# Altium schematic sheet External Power Amplifier.SchDoc
size A4; SheetNumber: 3; SheetTotal: 10
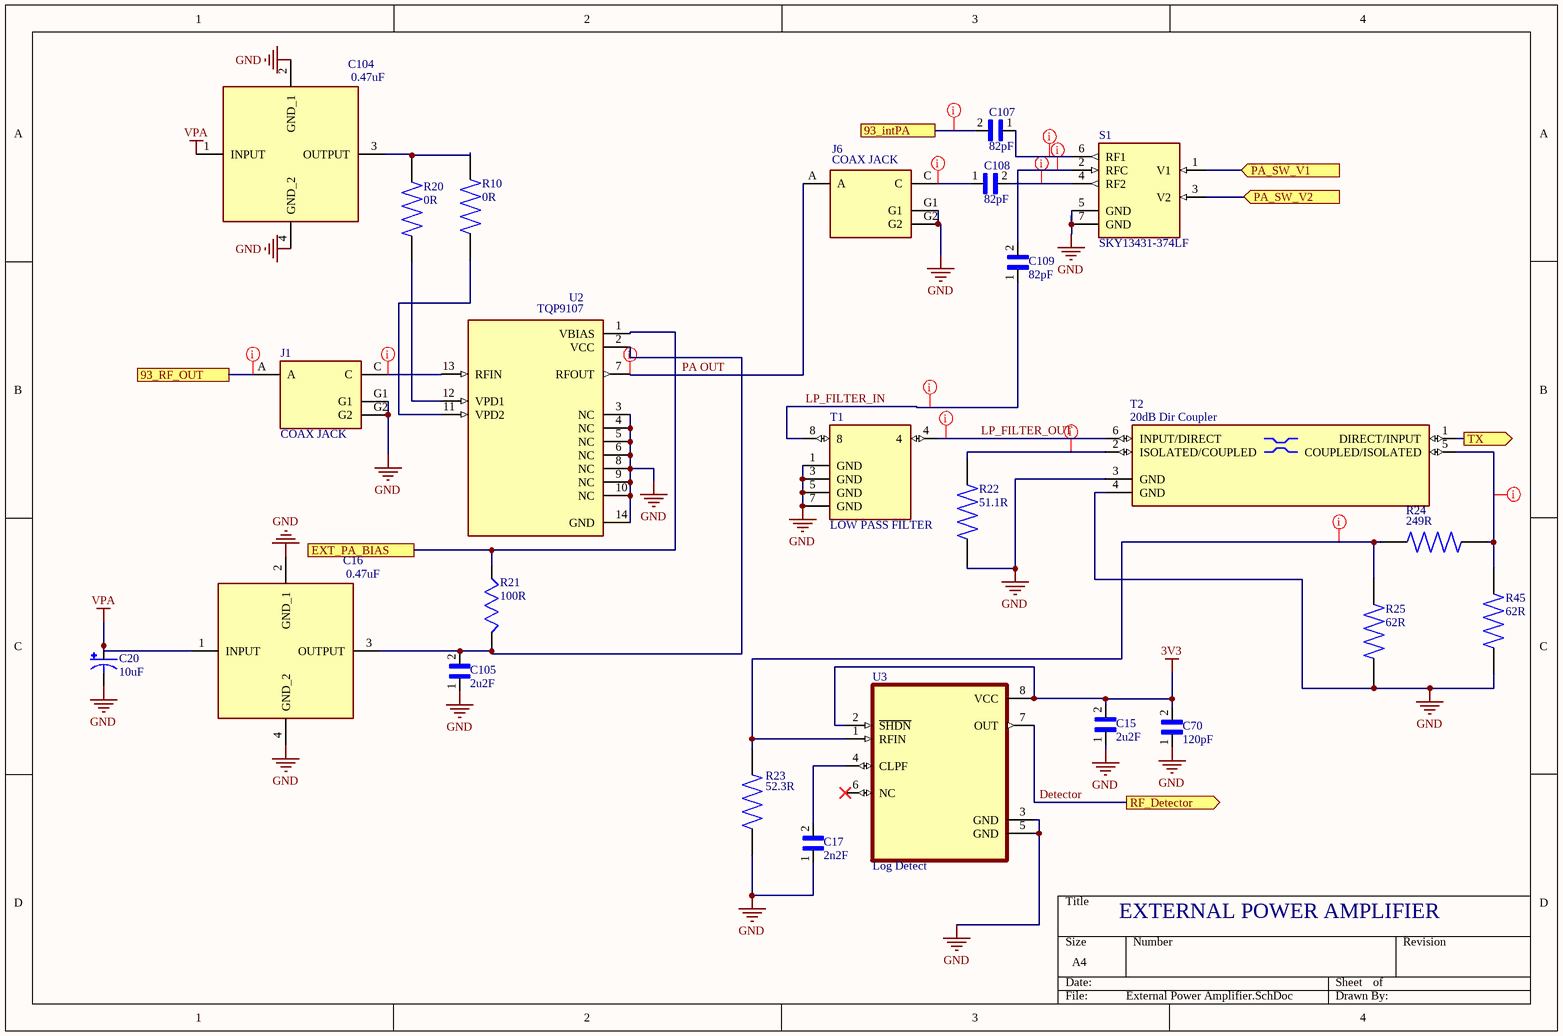
[diagram p0: External Power Amplifier.SchDoc]

## Parts
C15  2u2F  [CAPC0603X35N]
C16  0.47uF  [NFM18CC101R1C3D]
C17  2n2F  [CAPC1005X55N]
C20  10uF  [2917(POL)]
C70  120pF  [CAPC0603X33N]
C104  0.47uF  [NFM18CC101R1C3D]
C105  2u2F  [CAPC0603X35N]
C107  82pF  [CAPC1005X55N]
C108  82pF  [CAPC1005X55N]
C109  82pF  [CAPC1005X55N]
J1  COAX JACK  [SW_MS-156HF(01)]
J6  COAX JACK  [SW_MS-156HF(01)]
R10  0R  [RESC1005X37N]
R20  0R  [RESC1005X37N]
R21  100R  [RESC1005X40]
R22  51.1R  [RESC1005X40N]
R23  52.3R  [RES_ERJ2RKF52R3X]
R24  249R  [RESC1005X40N]
R25  62R  [RESC1005X40N]
R45  62R  [RESC1005X40N]
S1  SKY13431-374LF  [SW_SKY13431-374LF]
T1  LOW PASS FILTER  [FIL_0900LP15B0063E]
T2  20dB Dir Coupler  [COUPLER_DC1722J5020AHF]
U2  TQP9107  [IC_TQP9107]
U3  Log Detect  [SOP65P490X110-8N]

## Ports
93_intPA (see System Overview[2A], UHF RFID READER IC[4C]), 93_RF_OUT (see System Overview[2A], UHF RFID READER IC[4A]), EXT_PA_BIAS (see System Overview[2A], External interfaces and connections[4C]), PA_SW_V1 (in, see System Overview[2A], External interfaces and connections[3C], Microcontroller[1B]), PA_SW_V2 (in, see System Overview[2B], External interfaces and connections[3D], Microcontroller[3A]), RF_Detector (out, see System Overview[2A], External interfaces and connections[4D], Microcontroller[2A]), TX (out, see System Overview[3A], Carrier Cancellation Circuit[1B])

## Nets
3V3: C15.2 C70.2 U3.2(~{SHDN}) U3.8(VCC)
GND: C15.1 C16.2(GND_1) C16.4(GND_2) C17.1 C20.2(NEG) C70.1 C104.2(GND_1) C104.4(GND_2) C105.1 J1.G1 J1.G2 J6.G1 J6.G2 R22.1 R23.1 R25.1 R45.1 S1.5(GND) S1.7(GND) T1.1(GND) T1.3(GND) T1.5(GND) T1.7(GND) T2.3(GND) T2.4(GND) U2.3(NC) U2.4(NC) U2.5(NC) U2.6(NC) U2.8(NC) U2.9(NC) U2.10(NC) U2.14(GND) U3.3(GND) U3.5(GND)
VPA: C16.1(INPUT) C20.1(POS) C104.1(INPUT)
93_intPA: C107.2 ; port 93_intPA
93_RF_OUT: J1.A ; port 93_RF_OUT
Detector: U3.7(OUT) ; port RF_Detector
EXT_PA_BIAS: R21.2 U2.1(VBIAS) ; port EXT_PA_BIAS
LP_FILTER_IN: C109.1 T1.8
LP_FILTER_OUT: T1.4 T2.6(INPUT/DIRECT)
PA OUT: J6.A U2.7(RFOUT)
PA_SW_V1: S1.1(V1) ; port PA_SW_V1
PA_SW_V2: S1.3(V2) ; port PA_SW_V2
TX: T2.1(DIRECT/INPUT) ; port TX
NetC16_3: C16.3(OUTPUT) C105.2 R21.1 U2.2(VCC)
NetC17_2: C17.2 U3.4(CLPF)
NetC104_3: C104.3(OUTPUT) R10.2 R20.2
NetC107_1: C107.1 S1.6(RF1)
NetC108_1: C108.1 J6.C
NetC108_2: C108.2 S1.4(RF2)
NetC109_2: C109.2 S1.2(RFC)
NetJ1_C: J1.C U2.13(RFIN)
NetR10_1: R10.1 U2.11(VPD2)
NetR20_1: R20.1 U2.12(VPD1)
NetR22_2: R22.2 T2.2(ISOLATED/COUPLED)
NetR23_2: R23.2 R24.1 R25.2 U3.1(RFIN)
NetR24_2: R24.2 R45.2 T2.5(COUPLED/ISOLATED)

Not connected (* = marked no-connect by the designer): U3 6(NC)*

## Layout directives
net class RF_50: 93_intPA, 93_RF_OUT, LP_FILTER_IN, LP_FILTER_OUT, NetC107_1, NetC108_1, NetC108_2, NetC109_2, NetJ1_C, NetR22_2, NetR23_2, NetR24_2, PA OUT

## Notes on the sheet
- EXTERNAL POWER AMPLIFIER

## Library data of the parts
C15 C105 = GRM033R60J225ME15D: SMD Capacitor X5R(EIA) with Capacitance: 2.2uF Tol. 20%. Rated Voltage: 6.3Vdc; Package: None; Price: None; Value: *; MP: GRM033R60J225ME15D; Availability: Unavailable
C16 C104 = NFM18PS474R0J3D: Capacitor; Manufacturer_Name: Murata Electronics; Datasheet Link: https://psearch.en.murata.com/capacitor/product/NFM18PS474R0J3%23.html; Height: 0.7mm; Manufacturer_Part_Number: NFM18PS474R0J3D; Mouser Part Number: 81-NFM18PS474R0J3D; Mouser Price/Stock: https://www.mouser.co.uk/ProductDetail/Murata-Electronics/NFM18PS474R0J3D?qs=OWtbBJ4e7yHgIGJxSdBqtA%3D%3D; Arrow Part Number: NFM18PS474R0J3D; Arrow Price/Stock: https://www.arrow.com/en/products/nfm18ps474r0j3d/murata-manufacturing?region=nac
C17 = GRM155R71H222KA01D: SMD capacitor X7R(EIA) with capacitance 2200pF Tol.10%. Rated voltage 50Vdc 125C; MF: Murata; SnapEDA_Link: https://www.snapeda.com/parts/GRM155R71H222KA01D/Murata%20Electronics%20North%20America/view-part/326477/?ref=snap; Package: 1005 Taiyo Yuden; Value: *; MP: GRM155R71H222KA01D; Purchase-URL: https://pricing.snapeda.com/search/part/GRM155R71H222KA01D/?ref=eda; Availability: Good; Price: None
C20 = ECASD41C106M060K00: 10 ÂµF 16 V Aluminum - Polymer Capacitors 2917 (7343 Metric) 60mOhm 1000 Hrs @ 105Â°C; MF: Murata Electronics; SnapEDA_Link: https://www.snapeda.com/parts/ECASD41C106M060K00/Murata+Electronics+North+America/view-part/?ref=snap; Package: 2917 Murata; Value: *; MP: ECASD41C106M060K00; Check_prices: https://www.snapeda.com/parts/ECASD41C106M060K00/Murata+Electronics+North+America/view-part/?ref=eda
C70 = GRM0335C1H121JA01D: 0201 120 pF 50 V Â±5% Tolerance C0G SMT Multilayer Ceramic Capacitor; MF: Murata Electronics; Check_prices: https://www.snapeda.com/parts/GRM0335C1H121JA01D/Murata%20Electronics%20North%20America/view-part/1767262/?ref=eda; Value: *; Purchase-URL: https://pricing.snapeda.com/search/part/GRM0335C1H121JA01D/?ref=eda; Package: 0603 Taiyo Yuden; Price: None; MP: GRM0335C1H121JA01D; Availability: In Stock; SnapEDA_Link: https://www.snapeda.com/parts/GRM0335C1H121JA01D/Murata%20Electronics%20North%20America/view-part/1767262/?ref=snap
C107-C109 = GRM1555C1H820GA01J: CAP CER 82PF 50V C0G/NP0 0402; Package: None; Price: None; Value: *; MP: GRM1555C1H820GA01J; Availability: Unavailable
J1 J6 = MS-156HF(01): Coaxial Switch - 4mm Plug Dia Connector Receptacle, Female Socket 50Ohm Surface Mount Solder; MF: Hirose Electric; Package: None; MP: MS-156HF(01); Value: *; SnapEDA_Link: https://www.snapeda.com/parts/MS-156HF(01)/Hirose%20Electric%20Co%20Ltd/view-part/1243878/?ref=snap; Price: None; Availability: Unavailable
R10 R20 = RC0402JR-070RL: MF: {'manufacturer': u'YAGEO'}; Package: None; Price: None; Value: *; MP: RC0402JR-070RL; Availability: Unavailable
R21 = RC0402FR-07100RL: 100 Ohms Â±1% 0.063W, 1/16W Chip Resistor 0402 (1005 Metric) Moisture Resistant Thick Film; MF: Yageo; SnapEDA_Link: https://www.snapeda.com/parts/RC0402FR-07100RL/Yageo/view-part/?ref=snap; Package: 0402 Yageo; MP: RC0402FR-07100RL; Check_prices: https://www.snapeda.com/parts/RC0402FR-07100RL/Yageo/view-part/?ref=eda; Purchase-URL: https://pricing.snapeda.com/search/part/RC0402FR-07100RL/?ref=eda; Price: None; Value: *; Availability: In Stock
R22 = RC0402FR-0751R1L: Res Thick Film 0402 51.1 Ohm 1% 1/16W ?100ppm/C Molded SMD SMD Paper T/R; MF: {'manufacturer': u'YAGEO'}; Package: None; Price: None; Value: *; MP: RC0402FR-0751R1L; Availability: Unavailable
R23 = ERJ2RKF52R3X: Availability: Unavailable; Price: None; MP: ERJ2RKF52R3X; Value: *; Package: None
R24 = RC0402FR-07249RL: Res Thick Film 0402 249 Ohm 1% 1/16W ?100ppm/C Molded SMD SMD Paper T/R; Package: None; Price: None; Value: *; MP: RC0402FR-07249RL; Availability: Unavailable
R25 R45 = RC0402FR-0762RL: RESISTOR, 0402 0.063W 1% 62R; Resistance:62ohm; Resistance Tolerance:Â± 1%; Power Rating:63mW; Voltage Rating:50V; Temperature Coefficient:Â± 100ppm/Â°C; Resistor Element Material:Thick Film; Resistor Case Style:0402; Resistor Mounting:SMD; SVHC:No SVHC (19-Dec-2011); External Depth:0.35mm; External Length / Height:1mm; External Width:0.5mm; No. of Pins:2; Operating Temperature Range:-55Â°C to +155Â°C; Overload Voltage:100V; Package / Case:0402; Series:RC32H; Temperature Coeff. +:100ppm/Â°C; Temperature Coeff. -:100ppm/Â°C; Package: None; Price: None; Value: *; MP: RC0402FR-0762RL; Availability: Unavailable
S1 = SKY13431-374LF: RF Switch IC WiMax, WLAN SPDT 6GHz 50Ohm 6-DFN (1.5x1.5); MF: Skyworks Solutions; Package: XFDFN-6 Skyworks Solutions; MP: SKY13431-374LF; Purchase-URL: https://pricing.snapeda.com/search/part/SKY13431-374LF/?ref=eda; Value: *; SnapEDA_Link: https://www.snapeda.com/parts/SKY13431-374LF/Skyworks%20Solutions%20Inc./view-part/1233094/?ref=snap; Availability: Warning; Price: None
T1 = 0900LP15B0063E: 911.5MHz Frequency Low Pass RF Filter (Radio Frequency) 97MHz Bandwidth 0.9dB 0805 (2012 Metric), 8 PC Pad; MF: Johanson Technology; MP: 0900LP15B0063E; Value: *; Package: 0805 Johanson; Price: None; Availability: Bad; SnapEDA_Link: https://www.snapeda.com/parts/0900LP15B0063E/Johanson%20Technology%20Inc./view-part/2720562/?ref=snap
T2 = DC1722J5020AHF: RF Directional Coupler General Purpose 1.7GHz ~ 2.2GHz 19.9dB 2W 0805 (2012 Metric); MF: Anaren; MP: DC1722J5020AHF; Package: 0805 Anaren Microwave; Price: None; Availability: Unavailable; SnapEDA_Link: https://www.snapeda.com/parts/DC1722J5020AHF/Anaren/view-part/480148/?ref=snap; Value: *
U2 = TQP9107: RF Amplifier 699-960MHz PAE 31% Gain 35.5dB; MF: Qorvo; Package: None; Availability: Warning; Value: *; MP: TQP9107; SnapEDA_Link: https://www.snapeda.com/parts/TQP9107/Qorvo/view-part/1064589/?ref=snap; Price: None; Purchase-URL: https://pricing.snapeda.com/search/part/TQP9107/?ref=eda
U3 = MAX4003EUA+T: 100MHz to 2500MHz, 45dB RF Detector in a UCSP; MF: Analog Devices; SnapEDA_Link: https://www.snapeda.com/parts/MAX4003EUA+T/Analog+Devices/view-part/?ref=snap; Package: MICRO MAX-8 Maxim; Value: *; MP: MAX4003EUA+T; Check_prices: https://www.snapeda.com/parts/MAX4003EUA+T/Analog+Devices/view-part/?ref=eda